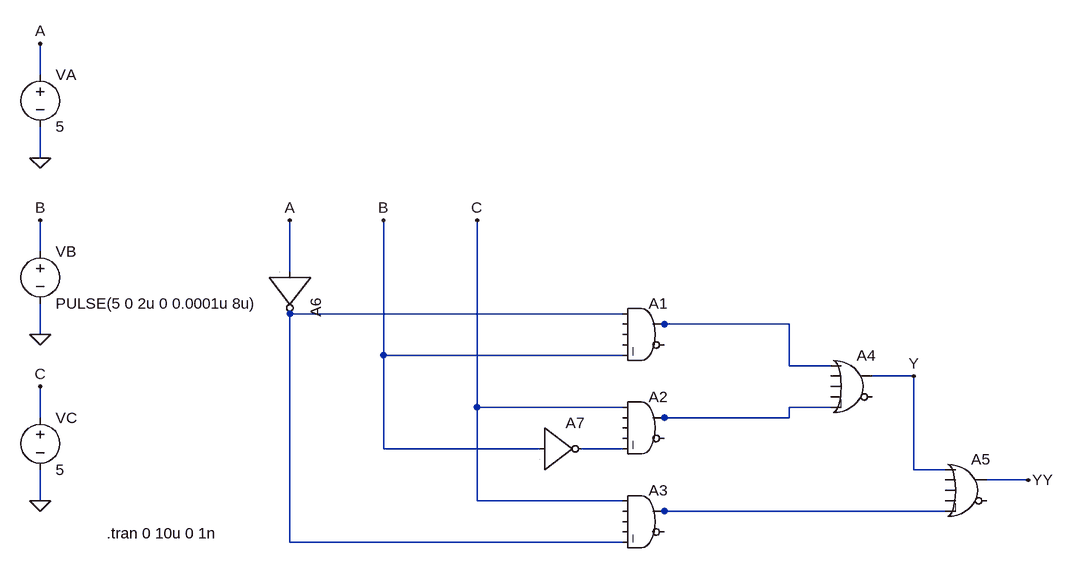
[diagram p0: schematic Modelo ideal.asc]
Modelo ideal.asc, the LTspice schematic file:
Version 4
SHEET 1 1856 680
WIRE 288 -416 288 -464
WIRE 288 -288 288 -336
WIRE 288 -144 288 -192
WIRE 672 -112 672 -192
WIRE 1184 -48 672 -48
WIRE 1248 -32 1232 -32
WIRE 1440 -32 1248 -32
WIRE 288 -16 288 -64
WIRE 816 16 816 -192
WIRE 1184 16 816 16
WIRE 1440 32 1440 -32
WIRE 1504 32 1440 32
WIRE 1632 48 1568 48
WIRE 960 96 960 -192
WIRE 1184 96 960 96
WIRE 1504 96 1440 96
WIRE 288 112 288 64
WIRE 1248 112 1232 112
WIRE 1440 112 1440 96
WIRE 1440 112 1248 112
WIRE 816 160 816 16
WIRE 1056 160 816 160
WIRE 1184 160 1120 160
WIRE 1632 192 1632 48
WIRE 1680 192 1632 192
WIRE 1808 208 1744 208
WIRE 288 240 288 192
WIRE 960 240 960 96
WIRE 1184 240 960 240
WIRE 1248 256 1232 256
WIRE 1680 256 1248 256
WIRE 672 304 672 -48
WIRE 1184 304 672 304
FLAG 288 240 0
FLAG 288 -16 0
FLAG 288 -288 0
FLAG 288 -464 A
FLAG 288 -192 B
FLAG 288 64 C
FLAG 672 -192 A
FLAG 816 -192 B
FLAG 960 -192 C
FLAG 1632 48 Y
FLAG 1808 208 YY
SYMBOL voltage 288 -432 R0
WINDOW 123 0 0 Left 0
WINDOW 39 0 0 Left 0
SYMATTR InstName VA
SYMATTR Value 5
SYMBOL voltage 288 -160 R0
WINDOW 123 0 0 Left 0
WINDOW 39 0 0 Left 0
SYMATTR InstName VB
SYMATTR Value PULSE(5 0 2u 0 0.0001u 8u)
SYMBOL voltage 288 96 R0
WINDOW 123 0 0 Left 0
WINDOW 39 0 0 Left 0
SYMATTR InstName VC
SYMATTR Value 5
SYMBOL Digital\\and 1216 -80 R0
SYMATTR InstName A1
SYMBOL Digital\\and 1216 64 R0
SYMATTR InstName A2
SYMBOL Digital\\and 1216 208 R0
SYMATTR InstName A3
SYMBOL Digital\\or 1536 0 R0
SYMATTR InstName A4
SYMBOL Digital\\or 1712 160 R0
SYMATTR InstName A5
SYMBOL Digital\\inv 736 -112 R90
SYMATTR InstName A6
SYMBOL Digital\\inv 1056 96 R0
SYMATTR InstName A7
TEXT 390 290 Left 2 !.tran 0 10u 0 1n

The netlist it stands for:
* Modelo ideal.asc
VA A 0 5
VB B 0 PULSE(5 0 2u 0 0.0001u 8u)
VC C 0 5
A1 N001 0 0 0 B 0 N002 0 AND
A2 C 0 0 0 N004 0 N003 0 AND
A3 C 0 0 0 N001 0 N005 0 AND
A4 N002 0 0 0 N003 0 Y 0 OR
A5 Y 0 0 0 N005 0 YY 0 OR
A6 A 0 0 0 0 N001 0 0 BUF
A7 B 0 0 0 0 N004 0 0 BUF
.tran 0 10u 0 1n
.backanno
.end